# EAGLE design murdock_mcu_v3 (EAGLE 6.3)
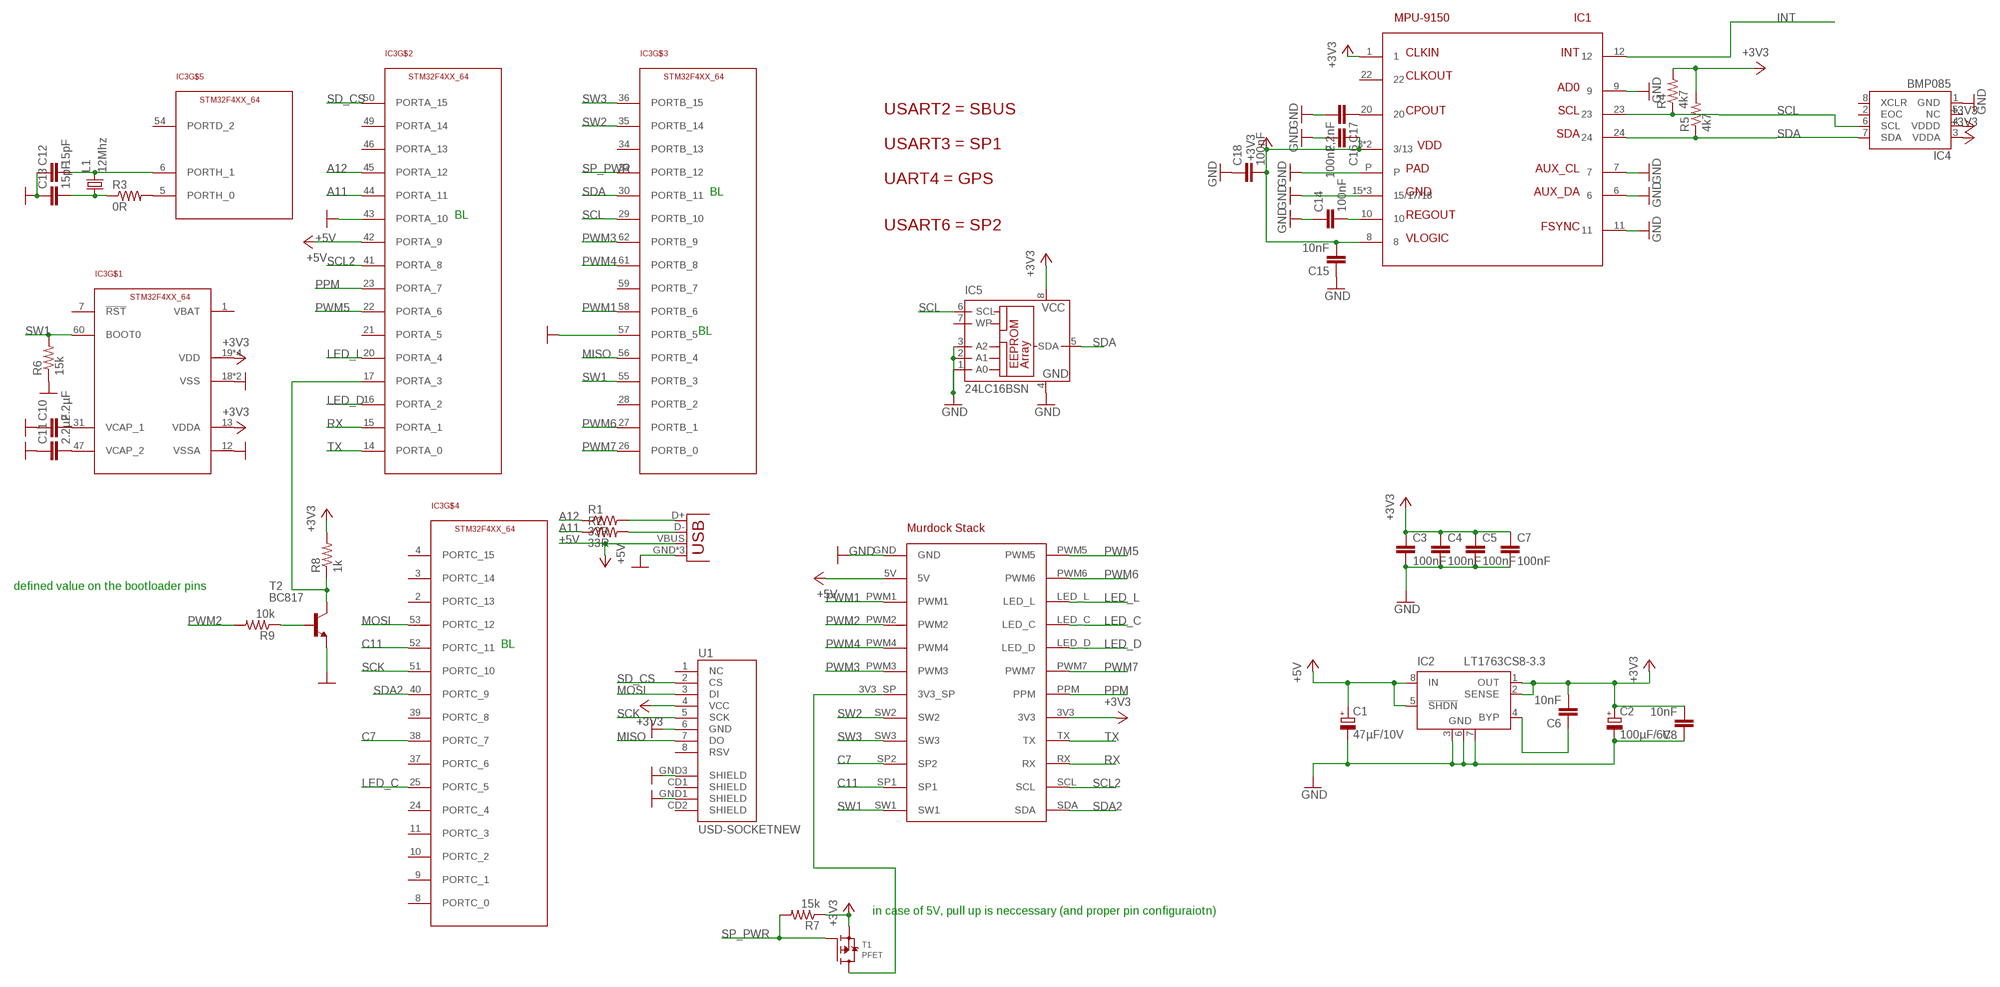
[diagram p0: schematic, sheet 1]

## Parts
C1  47µF/10V  CPOL-EUSMCC  [SMC_C]
C2  100µF/6V  CPOL-EUSMCC  [SMC_C]
C3  100nF  CAP0402-CAP  [0402-CAP]
C4  100nF  CAP0402-CAP  [0402-CAP]
C5  100nF  CAP0402-CAP  [0402-CAP]
C6  10nF  C-EUC0402  [C0402]
C7  100nF  CAP0402-CAP  [0402-CAP]
C8  10nF  C-EUC0402  [C0402]
C10  2.2µF  CAP0805  [0805]
C11  2.2µF  CAP0805  [0805]
C12  15pF  CAP0402-CAP  [0402-CAP]
C13  15pF  CAP0402-CAP  [0402-CAP]
C14  100nF  CAP0402-CAP  [0402-CAP]
C15  10nF  CAP0402-CAP  [0402-CAP]
C16  100nF  CAP0402-CAP  [0402-CAP]
C17  2,2nF  CAP0402-CAP  [0402-CAP]
C18  100nF  CAP0402-CAP  [0402-CAP]
IC1  MPU-9150  [QFN24]
IC2  LT1763CS8-3.3  [SOIC8]
IC3  STM32F4XX_64  [TQFP64]
IC4  BMP085  [BMP085]
IC5  24LC16BSN  [SO-08]
JP1  USB-MICROB  [USB-MICROB]
L1  12Mhz  X22-OSCILLATOR  [X22]
R1  33R  RESISTOR0402-RES  [0402-RES]
R2  33R  RESISTOR0402-RES  [0402-RES]
R3  0R  RESISTOR0402-RES  [0402-RES]
R4  4k7  RESISTOR0402-RES  [0402-RES]
R5  4k7  RESISTOR0402-RES  [0402-RES]
R6  15k  RESISTOR0402-RES  [0402-RES]
R7  15k  RESISTOR0402-RES  [0402-RES]
R8  1k  RESISTOR0402-RES  [0402-RES]
R9  10k  RESISTOR0402-RES  [0402-RES]
T1  PFET  MOSFET-P  [SOT23-R]
T2  BC817  BC847  [SOT23]
U1  USD-SOCKETNEW  [MICRO-SD-SOCKET-PP]
X2  MURDOCK_STACK  [MURDOCK_STACK]

## Nets
+3V3: C2.+ C3.1 C4.1 C5.1 C6.2 C7.1 C8.2 C15.2 C16.1 C18.2 IC1.1 IC1.3(3/13) IC1.8 IC1.13(3/13) IC2.1(OUT) IC2.2(SENSE) IC3.13(VDDA) IC3.19(VDD) IC3.32(VDD) IC3.48(VDD) IC3.64(VDD) IC4.3(VDDA) IC4.4(VDDD) IC5.8(VCC) R4.2 R5.2 R7.1 R8.2 T1.2(S) U1.4(VCC) X2.3V3
+5V: C1.+ IC2.5(!SHDN) IC2.8(IN) IC3.42(PORTA_9) JP1.VBUS X2.5V
A11: IC3.44(PORTA_11) R2.1
A12: IC3.45(PORTA_12) R1.1
C7: IC3.38(PORTC_7) X2.SP2
C11: IC3.52(PORTC_11) X2.SP1
GND: C1.- C2.- C3.2 C4.2 C5.2 C7.2 C8.1 C10.1 C11.1 C12.1 C13.1 C14.1 C15.1 C16.2 C17.2 C18.1 IC1.6 IC1.7 IC1.9 IC1.11 IC1.15(15/17/18) IC1.17(15/17/18) IC1.18(15/17/18) IC1.P IC2.3(GND) IC2.6(GND) IC2.7(GND) IC3.12(VSSA) IC3.18(VSS) IC3.43(PORTA_10) IC3.57(PORTB_5) IC3.63(VSS) IC4.1(GND) IC5.1(A0) IC5.2(A1) IC5.3(A2) IC5.4(GND) JP1.GND JP1.MT1(GND) JP1.MT2(GND) R6.1 T2.2(E) U1.6(GND) U1.GND1(SHIELD) U1.GND3(SHIELD) X2.GND
INT: IC1.12
LED_C: IC3.25(PORTC_5) X2.LED_C
LED_D: IC3.16(PORTA_2) X2.LED_D
LED_L: IC3.20(PORTA_4) X2.LED_L
MISO: IC3.56(PORTB_4) U1.7(DO)
MOSI: IC3.53(PORTC_12) U1.3(DI)
N$1: JP1.D- R2.2
N$2: JP1.D+ R1.2
N$3: C10.2 IC3.31(VCAP_1)
N$4: C11.2 IC3.47(VCAP_2)
N$5: IC3.5(PORTH_0) R3.2
N$6: C13.2 L1.1 R3.1
N$7: C12.2 IC3.6(PORTH_1) L1.3
N$8: T1.3(D) X2.3V3_SP
N$9: C14.2 IC1.10
N$10: C17.1 IC1.20
N$11: IC3.17(PORTA_3) R8.1 T2.3(C)
N$12: R9.1 T2.1(B)
N$13: C6.1 IC2.4(BYP)
PPM: IC3.23(PORTA_7) X2.PPM
PWM1: IC3.58(PORTB_6) X2.PWM1
PWM2: R9.2 X2.PWM2
PWM3: IC3.62(PORTB_9) X2.PWM3
PWM4: IC3.61(PORTB_8) X2.PWM4
PWM5: IC3.22(PORTA_6) X2.PWM5
PWM6: IC3.27(PORTB_1) X2.PWM6
PWM7: IC3.26(PORTB_0) X2.PWM7
RX: IC3.15(PORTA_1) X2.RX
SCK: IC3.51(PORTC_10) U1.5(SCK)
SCL: IC1.23 IC3.29(PORTB_10) IC4.6(SCL) IC5.6(SCL) R4.1
SCL2: IC3.41(PORTA_8) X2.SCL
SD_CS: IC3.50(PORTA_15) U1.2(CS)
SDA: IC1.24 IC3.30(PORTB_11) IC4.7(SDA) IC5.5(SDA) R5.1
SDA2: IC3.40(PORTC_9) X2.SDA
SP_PWR: IC3.33(PORTB_12) R7.2 T1.1(G)
SW1: IC3.55(PORTB_3) IC3.60(BOOT0) R6.2 X2.SW1
SW2: IC3.35(PORTB_14) X2.SW2
SW3: IC3.36(PORTB_15) X2.SW3
TX: IC3.14(PORTA_0) X2.TX
Unconnected: IC1.22 IC3.1(VBAT) IC3.2(PORTC_13) IC3.3(PORTC_14) IC3.4(PORTC_15) IC3.7(!RST) IC3.8(PORTC_0) IC3.9(PORTC_1) IC3.10(PORTC_2) IC3.11(PORTC_3) IC3.21(PORTA_5) IC3.24(PORTC_4) IC3.28(PORTB_2) IC3.34(PORTB_13) IC3.37(PORTC_6) IC3.39(PORTC_8) IC3.46(PORTA_13) IC3.49(PORTA_14) IC3.54(PORTD_2) IC3.59(PORTB_7) IC4.2(EOC) IC4.5(NC) IC4.8(XCLR) IC5.7(WP) U1.1(NC) U1.8(RSV) U1.CD1(SHIELD) U1.CD2(SHIELD)

## Notes on the sheet
- USART2 = SBUS
- USART3 = SP1
- UART4 = GPS
- BL
- BL
- USART6 = SP2
- BL
- defined value on the bootloader pins
- BL
- in case of 5V, pull up is neccessary (and proper pin configuraiotn)

## Library data of the parts
C1 C2 = rcl:CPOL-EU: POLARIZED CAPACITOR, European symbol
C3-C5 C7 C10-C13 = SparkFun-Capacitors:CAP: Capacitor Standard 0603 ceramic capacitor, and 0.1" leaded capacitor.
C6 C8 = rcl:C-EU: CAPACITOR, European symbol
C14-C18 = SparkFun:CAP: Capacitor Standard 0603 ceramic capacitor, and 0.1" leaded capacitor.
IC1 = seb:MPU-9150
IC2 = linear-technology:LT1763CS8: 500mA, Low Noise, LDO Micropower Regulators Source: http://cds.linear.com/docs/Datasheet/1763ff.pdf; MPN: LT1763CS8-3.3; OC_FARNELL: 1273617; OC_NEWARK: 57M6055
IC3 = stm32:STM32F4XX_64
IC4 = SparkFun-Sensors:BMP085: BMP085 Pressure Sensor Great little MEMS pressure sensor. SKU: COM-09603
IC5 = microchip:24*: Serial EEPROM I2C; MF: MICROCHIP; MPN: 24LC16B/SN; OC_FARNELL: 9757945; OC_NEWARK: 12C2012
JP1 = SparkFun-Connectors:USB: USB Connectors USB-B-PTH is fully proven SKU : PRT-00139/CONN-08278 USB-miniB is fully proven SKU : PRT-00587 USB-A-PCB is untested. USB-A-H is throughly reviewed, but untested. Spark Fun Electronics SKU : PRT-00437 USB-B-SMT is throughly reviewed, but untested. Needs silkscreen touching up. USB-A-S has not been used/tested USB-MB-H has not been used/tested USB-MICROB has been used. CONN-09505; PROD_ID: CONN-09505
L1 = seb:X22-OSCILLATOR
R1-R3 R7-R9 = SparkFun-Resistors:RESISTOR: Resistor
R4-R6 = SparkFun:RESISTOR: Resistor
T1 = microbuilder:MOSFET-P: P-Channel Mosfet LEGEND VDS: Voltage Drain-Source ID: Drain Current RDS(ON): Drain-Source On-State Resistance VGS(TH): Gate-Source Threshold Voltage CISS: Drain-Source Input Capacitance SOT-23 Name VDS ID RDS(ON) VGS(TH) CISS Order Number IRLML5103 30V 760mA 600 mOhm -- 75pF @ 25V Digikey: IRLML5103PBFCT-ND IRLML6401 12V 4.3A 50 mOhm 950mV @ 250µA 830pF @ 10V Digikey: IRLML6401PBFTR-ND NTR0202PL 20V 400mA 800 mOhm 2.3V @ 250uA 70pF @ 5V Digikey: NTR0202PLT1GOSTR-ND NTR4101PT1G 20V 1.8A 85 mOhm 1.2V @ 250uA 675pF @ 10V Digikey: NTR4101PT1GOSCT-ND DMP2004K 20V 600mA 900 mOhm 1V @ 250uA 175pF @ 16V Digikey: DMP2004KDICT-ND PMV65XP 20V 3.9A 76 mOhm 950mV @ 1mA 725pF @ 20V Digikey: 568-2358-2-ND TO-252 Name VDS ID RDS(ON) VGS(TH) CISS Order Number AOD417 30V 25A 34 mOhm 3V @ 250µA 920pF @ 15V Digikey: 785-1106-2-ND
T2 = transistor:BC847: NPN TRANSISTOR
U1 = SparkFun-Connectors:USD-SOCKET: microSD Socket Push-push type uSD socket. Schematic element and footprint production proven. Spark Fun Electronics SKU : PRT-00127. tDoc lines correctly indicate media card edge positions when inserting (unlocked, locked, depressed).
X2 = murdock:MURDOCK_STACK

## Board
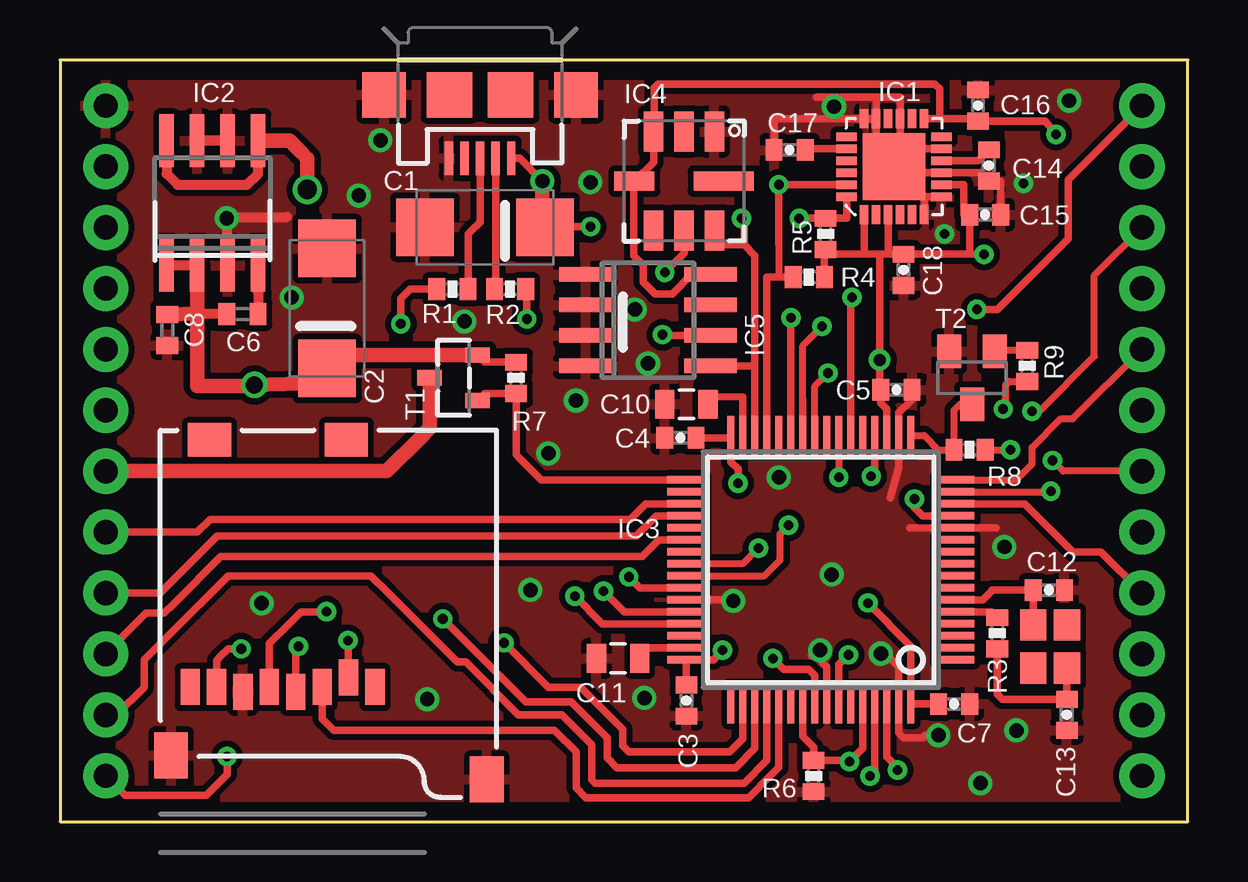
[diagram p1: board, top side]
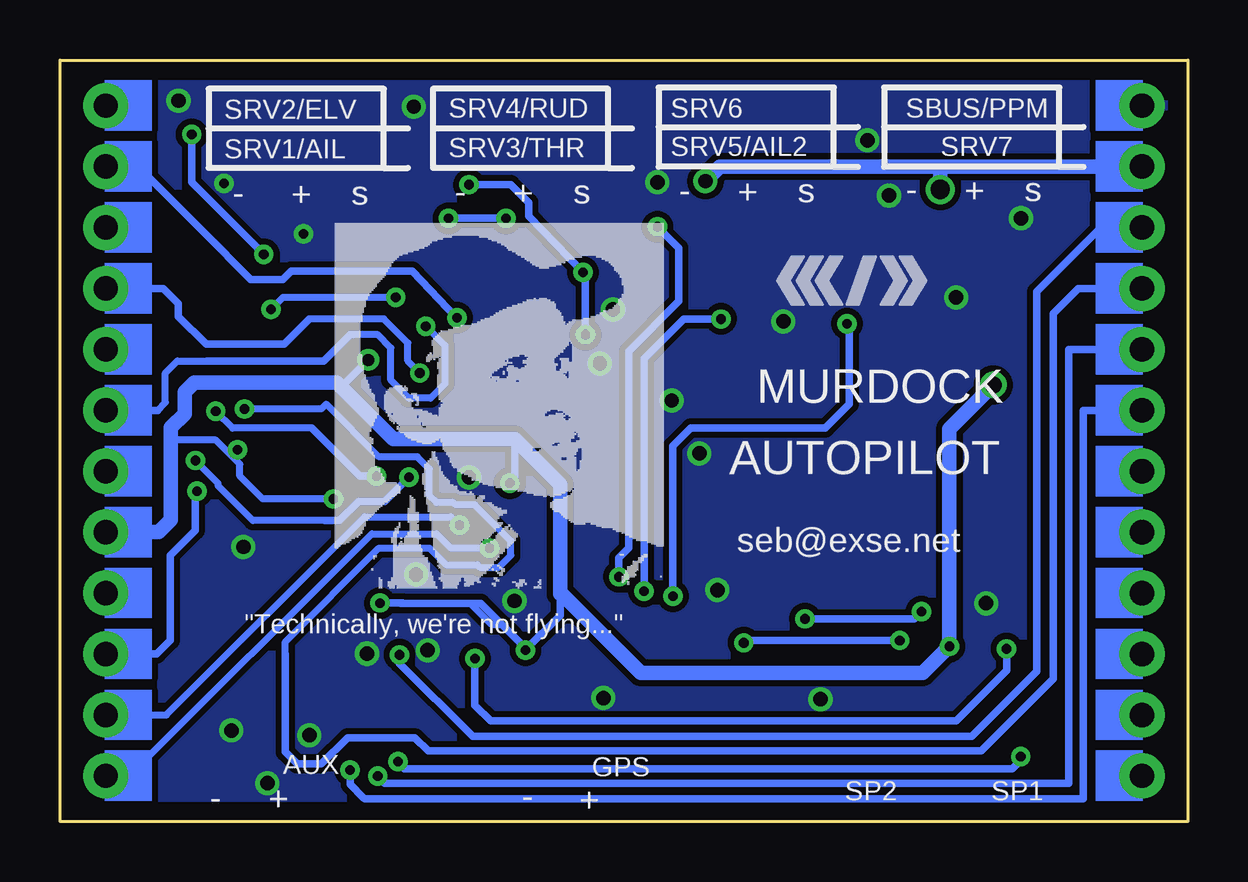
[diagram p2: board, bottom side, seen from below]

Size 46.99 x 31.75 mm. Coordinates in mm from the lower left corner, seen from the top.
Copper layers (1*16): Top 0.035mm / dielectric 1.5mm / Bottom 0.035mm
Design rules "default": minimum track width 10mil, minimum drill 0.4mm, track to track 8mil, track to pad 8mil, pad to pad 8mil, via to via 8mil, smd to smd 8mil, copper to edge 30mil, drill to drill 8mil, minimum pad ring 10mil, minimum via ring 8mil, stop-mask expansion 4mil, vias tented up to drill 1.5mm, thermal gap 10mil

### Footprints (pad centres in the part's own frame; a part is rotated, then mirrored left to right if it is on the bottom)
SMC_C = smd 2.4 x 2.4: + -2.5,0; - 2.5,0
0402-CAP = smd 0.7 x 0.9: 1 -0.65,0; 2 0.65,0
C0402 = smd 0.7 x 0.9: 1 -0.65,0; 2 0.65,0
0805 = smd 0.8 x 1.2: 1 -0.9,0; 2 0.9,0
QFN24 = smd 0.8 x 0.35: 1 -2,1.25; 2 -2,0.75; 3 -2,0.25; 4 -2,-0.25; 5 -2,-0.75; 6 -2,-1.25; 13 2,-1.25; 14 2,-0.75; 15 2,-0.25; 16 2,0.25; 17 2,0.75; 18 2,1.25 | smd 0.35 x 0.85: 7 -1.25,-1.975; 8 -0.75,-1.975; 9 -0.25,-1.975; 10 0.25,-1.975; 11 0.75,-1.975; 12 1.25,-1.975; 19 1.25,1.975; 20 0.75,1.975; 21 0.25,1.975; 22 -0.25,1.975; 23 -0.75,1.975; 24 -1.25,1.975 | smd 2.8 x 2.6: P 0,0
SOIC8 = smd 0.6 x 2.2: 1 -1.905,-2.6; 2 -0.635,-2.6; 3 0.635,-2.6; 4 1.905,-2.6; 5 1.905,2.6; 6 0.635,2.6; 7 -0.635,2.6; 8 -1.905,2.6
TQFP64 = smd 0.3 x 1.6: 1 -3.75,-5.6; 2 -3.25,-5.6; 3 -2.75,-5.6; 4 -2.25,-5.6; 5 -1.75,-5.6; 6 -1.25,-5.6; 7 -0.75,-5.6; 8 -0.25,-5.6; 9 0.25,-5.6; 10 0.75,-5.6; 11 1.25,-5.6; 12 1.75,-5.6; 13 2.25,-5.6; 14 2.75,-5.6; 15 3.25,-5.6; 16 3.75,-5.6; 33 3.75,5.6; 34 3.25,5.6; 35 2.75,5.6; 36 2.25,5.6; 37 1.75,5.6; 38 1.25,5.6; 39 0.75,5.6; 40 0.25,5.6; 41 -0.25,5.6; 42 -0.75,5.6; 43 -1.25,5.6; 44 -1.75,5.6; 45 -2.25,5.6; 46 -2.75,5.6; 47 -3.25,5.6; 48 -3.75,5.6 | smd 1.6 x 0.3: 17 5.6,-3.75; 18 5.6,-3.25; 19 5.6,-2.75; 20 5.6,-2.25; 21 5.6,-1.75; 22 5.6,-1.25; 23 5.6,-0.75; 24 5.6,-0.25; 25 5.6,0.25; 26 5.6,0.75; 27 5.6,1.25; 28 5.6,1.75; 29 5.6,2.25; 30 5.6,2.75; 31 5.6,3.25; 32 5.6,3.75; 49 -5.6,3.75; 50 -5.6,3.25; 51 -5.6,2.75; 52 -5.6,2.25; 53 -5.6,1.75; 54 -5.6,1.25; 55 -5.6,0.75; 56 -5.6,0.25; 57 -5.6,-0.25; 58 -5.6,-0.75; 59 -5.6,-1.25; 60 -5.6,-1.75; 61 -5.6,-2.25; 62 -5.6,-2.75; 63 -5.6,-3.25; 64 -5.6,-3.75
BMP085 = smd 1.67 x 0.8: 1 -2.065,1.27; 2 -2.065,0; 3 -2.065,-1.27; 5 2.065,-1.27; 6 2.065,0; 7 2.065,1.27 | smd 0.8 x 1.67: 4 0,-2.065 | smd 0.8 x 2.5: 8 0,1.65
SO-08 = smd 0.6 x 2.2: 1 -1.905,-2.6; 2 -0.635,-2.6; 3 0.635,-2.6; 4 1.905,-2.6; 5 1.905,2.6; 6 0.635,2.6; 7 -0.635,2.6; 8 -1.905,2.6
USB-MICROB = smd 0.35 x 1.4: D+ 0,2.65; D- -0.65,2.65; GND 1.3,2.65; ID 0.65,2.65; VBUS -1.3,2.65 | smd 1.8 x 1.9: MT1 -4,0; MT2 4,0 | smd 1.9 x 1.9: P$1 -1.27,0; P$2 1.27,0
X22 = smd 1.3 x 1.1: 1 0.9,0.7; 2 -0.9,0.7; 3 -0.9,-0.7; 4 0.9,-0.7
0402-RES = smd 0.7 x 0.9: 1 -0.65,0; 2 0.65,0
SOT23-R = smd 0.635 x 1.016: 1 -0.95,-1; 2 0.95,-1; 3 0,1
SOT23 = smd 1 x 1.4: 1 -0.95,-1.1; 2 0.95,-1.1; 3 0,1.1
MICRO-SD-SOCKET-PP = smd 0.8 x 1.5: 1 -8.94,10.7; 2 -7.84,10.3; 3 -6.74,10.7; 4 -5.64,10.9; 5 -4.54,10.7; 6 -3.44,10.9; 7 -2.34,10.7; 8 -1.24,10.7 | smd 1.8 x 1.4: CD1 -2.05,0.4; CD2 -7.75,0.4 | smd 1.4 x 1.9: GND1 -13.6,14.55; GND3 -0.45,13.55
MURDOCK_STACK = drill 1.016 pad 1.88: 3V3 45.085,12.065; 3V3_SP 1.905,14.605; 5V 1.905,27.305; GND 1.905,29.845; LED_C 45.085,22.225; LED_D 45.085,19.685; LED_L 45.085,24.765; PPM 45.085,14.605; PWM1 1.905,24.765; PWM2 1.905,22.225; PWM3 1.905,17.145; PWM4 1.905,19.685; PWM5 45.085,29.845; PWM6 45.085,27.305; PWM7 45.085,17.145; RX 45.085,6.985; SCL 45.085,4.445; SDA 45.085,1.905; SP1 1.905,4.445; SP2 1.905,6.985; SW1 1.905,1.905; SW2 1.905,12.065; SW3 1.905,9.525; TX 45.085,9.525

### Placement (x,y rotation side)
C1  17.71,24.78 180 top
C2  11.13,21.39 90 top
C3  26.1,5.05 270 top
C4  25.85,16 180 top
C5  34.85,18 0 top
C6  7.6,21.16 180 top
C7  37.25,4.9 0 top
C8  4.47,20.49 90 top
C10  26.1,17.4 0 top
C11  23.25,6.8 0 top
C12  41.2,9.65 180 top
C13  41.95,4.45 90 top
C14  38.7,27.35 90 top
C15  38.55,25.3 180 top
C16  38.25,29.85 90 top
C17  30.4,28 180 top
C18  35.15,23 90 top
IC1  34.75,27.3 90 top
IC2  6.35,25.79 0 top
IC3  31.7,10.5 90 top
IC4  26,26.7 270 top
IC5  24.5,20.9 270 top
JP1  17.5,30.3 180 top
L1  41.25,7.3 270 top
R1  16.35,22.2 0 top
R2  18.75,22.2 180 top
R3  39.05,7.85 90 top
R4  31.2,22.7 0 top
R5  31.9,24.5 270 top
R6  31.4,1.9 90 top
R7  19,18.5 270 top
R8  37.9,15.5 0 top
R9  40.3,19 270 top
T1  16.4,18.5 90 top
T2  38,18.5 180 top
U1  4.18,16.31 180 top
U$1  [C3D2_LOGO_SMALL]  17.1,22.55 0 bottom
X2  0,0 0 top

### Tracks (layer width: path | path; a pad name or v marks a point on that pad's centre or on a via)
+3V3  (via drill 0.4, 0.5, 0.7)
  Top 0.3: R8.2 v39.6,15.5
  Top 0.305: IC3.19 34.45,17.2 34.2,17.45 C5.1 34.15,18.05 v34.15,19.25 34.15,23.6 34.1,23.65 | C3.1 IC3.48 27.25,6.75 v27.6,7.15 | C4.1 27.95,16 IC3.32 27.95,15 28.25,14.7 v28.25,14.1 | C7.1 IC3.64 35.45,7.3 v33.66,9.11 | IC1.13 36.65,29.3 | 36.65,29.3 38.25,29.3 C16.1 41.05,29.2 v41.5,28.65 | IC1.8 37.65,26.55 37.65,25.3 C15.2 37.9,23.65 | 37.9,23.65 C18.2 34.5,23.65 | IC1.3 34.5,23.65 | 33.5,23.65 31.75,23.65 R5.2 31.85,23.8 R4.2 | 33.5,23.65 34.1,23.65 | 34.1,23.65 34.5,23.65 | IC1.1 33.5,23.65 | v38.5,23.65 37.9,23.65 | 36.65,29.3 36.65,30.55 36.45,30.75 24.9,30.75 24.75,30.6 24.75,28.79 IC4.3 24.73,27.5 IC4.4 23.9,26.66 23.9,23.6 24.3,23.2 24.3,22.5 24.8,22 25.5,22 26.3,22.8 IC5.8 | IC3.13 35.95,12.75 35.6,13.1 v35.6,13.45 | 5.71,18.45 5.71,18.5 | T1.2 17.7,19.15 R7.1 | U1.4 9.82,7.19 v9.93,7.3
  Top 0.406: C6.2 5.76,21.16 5.71,21.17 | IC2.2 IC2.1
  Top 0.61: 5.71,21.17 IC2.2 | C8.2 5.71,21.17 | 5.71,21.17 5.71,18.5 5.71,18.16 7.95,18.16 v8.1,18.2 8,18.2 10.77,18.27 C2.+ 11.13,19.45 T1.2
  Bottom 0.3: 27.6,7.25 28.55,8.2 29,8.2 29.9,9.1 32.8,9.1 | v35.6,13.45 38.55,13.45 39.5,14.4 39.5,14.9 40,15.4 | 40,15.4 40.5,15.9 42.37,15.9 | v39.6,15.5 39.7,15.4 40,15.4
  Bottom 0.305: 26.15,9.5 26.15,8.6 v27.6,7.15 27.6,7.25 29.45,9.1 32.8,9.1 32.71,9.11 v33.66,9.11 | 28.05,15.95 28.05,14.3 v28.25,14.1 | v38.5,23.65 41.5,26.65 v41.5,28.65 | v34.15,19.25 35.27,18.12
  Bottom 0.61: 26.15,9.5 26.15,9.55 | 26.15,9.55 26.15,14.05 28.05,15.95 33.1,15.95 35.27,18.12 35.45,18.3 41.4,18.3 41.8,17.9 41.8,17 42.37,16.43 42.37,15.9 42.37,12.57 42.88,12.06 X2.3V3 | 26.15,9.55 22.8,6.2 11.03,6.2 v9.93,7.3 9.93,16.37 v8.1,18.2
+5V  (via drill 0.4, 0.6, 0.8)
  Top 0.305: 19.15,27.65 JP1.VBUS 19.15,27.65 | v20.1,26.7 19.15,27.65 | IC3.42 24.15,9.75 v23.7,10.2 | v22.1,24.8 20.23,24.8 C1.+
  Top 0.406: IC2.8 4.45,27 4.9,26.55 7.8,26.55 8.25,27 8.25,27.23 IC2.5
  Top 0.61: IC2.5 9.56,28.39 10.05,27.9 10.31,27.64 v10.31,26.35 | C1.+ 20.1,24.39 v20.1,26.7
  Bottom 0.305: v23.7,10.2 23.7,11 23.3,11.4 23.3,19.6 21.2,21.7 21.2,23.9 v22.1,24.8
  Bottom 0.61: 9.35,27.3 X2.5V | 9.35,27.3 19.5,27.3 v20.1,26.7 | 9.35,27.3 10.31,27.3 v10.31,26.35
A11  (via drill 0.4)
  Top 0.305: IC3.44 23.5,8.75 v22.65,9.6 | R2.1 19.45,22.15 v19.45,20.95
  Bottom 0.305: v22.65,9.6 22.65,19.3 21,20.95 v19.45,20.95
A12  (via drill 0.4)
  Top 0.305: IC3.45 22.6,8.25 v21.45,9.4 | R1.1 14.6,22.2 14.3,21.9 14.2,21.8 v14.2,20.75
  Bottom 0.305: 14.15,20.75 v14.2,20.75 14.1,20.65 14.1,17.4 15.1,16.4 20.7,16.4 21.45,15.65 v21.45,9.4
C7
  Top 0.305: IC3.38 24.95,11.75 24.7,11.5 24.25,11.05 20.3,11.05 6.7,11.05 4.75,9.1 4.35,8.7 3.6,8.7 1.91,7 X2.SP2
C11
  Top 0.305: IC3.52 29.45,2.55 28.5,1.6 22.3,1.6 22.15,1.75 22.15,3.2 20.9,4.45 19.1,4.45 16.9,6.65 16.55,6.65 13.65,9.55 12.95,10.25 7,10.25 5.5,8.75 3.5,6.75 3.5,6.25 3.5,5.6 2.35,4.45 X2.SP1
GND  (via drill 0.4, 0.6)
  Top 0.305: C5.2 35.5,17.6 34.95,17.05 IC3.18 34.95,14.75 34.6,13.5 | 35.4,12.25 IC3.12 39,12.25 | 34.6,6.8 34.95,6.45 IC3.63 34.95,3.7 35.15,3.5 35.95,3.5 36.05,3.6 | IC1.11 35.8,28.05 35.6,27.85 | 35.6,27.85 35.6,27.3 | 35.6,27.3 35.85,27.05 IC1.9 38.35,27.05 C14.1 39.2,26.7 C15.1 | IC1.7 36,26.05 | 36,26.05 35.85,26.05 35.6,26.3 35.6,27.3 | IC1.6 36,26.05 | 35,28.05 IC1.15 35,30.2 34,30.2 | 35,28.05 35,27.85 | 35,27.85 35.6,27.85 | IC1.17 34,28.05 35,28.05 | IC1.17 IC1.18 29.75,29.3 C17.2 | 35,27.85 35,27.3 IC1.P | IC1.17 34,30.2 | 34,30.2 31.5,30.2 | IC3.43 28,9.25 v28.05,9.2 | IC3.57 31.95,6.45 31.5,6.9 31.3,6.9 v31.67,7.14
  Top 0.406: IC2.6 IC2.7 | IC2.3 6.99,23.84 6.95,25.2 9.45,25.2
  other vias: 16.85,20.85 29.95,14.35 42.05,30.05 21.5,17.55 36.6,3.6 39.85,3.8 39.35,11.45 32.15,10.3 19.6,9.65 23.95,21.35 13.35,28.4 12.45,26.1 6.95,25.15 8.4,9.1 24.35,5.15 32.25,29.8 36.85,24.5 24.5,19.1 9.65,21.85 22.1,26.65 38.35,1.6 34.2,7 20.35,15.35 15.3,5.1 40.15,26.6
  pour Top (isolate 0.254): 46.99,0 46.99,33.02 -0.95,33.02 -0.95,0
  pour Bottom (isolate 0.254): 46.99,0 46.99,33.02 -0.95,33.02 -0.95,0
LED_C  (via drill 0.4)
  Top 0.3: IC3.25 31.45,18.15 v32,18.7
  Bottom 0.3: v32,18.7 32,18.75 v32,18.7 | v32,18.7 32.5,19.2 32.5,19.95 33.5,20.95 36.6,20.95
  Bottom 0.305: X2.LED_C 42.7,22.23 42.57,22.1 42.06,21.59 42.06,21.06 40.9,19.9 37.65,19.9 36.6,20.95
LED_D
  Top 0.3: X2.LED_D 42.2,16.8 41.7,16.8 40.5,15.6 40.5,14.9 39.85,14.25 IC3.16
LED_L  (via drill 0.4)
  Top 0.3: X2.LED_L 43.1,22.78 43.1,19.4 40.8,17.1 v40.5,17.1
  Top 0.305: IC3.20 33.95,14.55 v33.8,14.4
  Bottom 0.3: 36.5,16.4 39.8,16.4 v40.5,17.1
  Bottom 0.305: v33.8,14.4 34.5,14.4 36.5,16.4
MISO  (via drill 0.4)
  Top 0.305: IC3.56 31.45,6.1 31.2,6.35 30.15,6.35 v29.7,6.8 | U1.7 6.52,6.72 6.7,6.9 7,7.2 v7.55,7.2
  Bottom 0.305: v29.7,6.8 29.7,4.85 29.05,4.2 9.65,4.2 8.9,4.95 7.55,6.3 v7.55,7.2
MOSI
  Top 0.305: IC3.53 29.95,2.25 29.6,1.9 28.7,1 21.9,1 21.5,1.4 21.5,2.9 20.6,3.8 17.3,3.8 16.45,3.8 14.3,3.8 13.55,3.8 11.4,3.8 11,4.2 10.92,4.28 U1.3
N$1
  Top 0.305: JP1.D- 18.15,22.65 18.1,22.6 R2.2
  Top 0.406: R2.2 17.98,22.12
N$2
  Top 0.305: JP1.D+ 17.5,25 17.1,24.6 17,24.5 R1.2
  Top 0.406: 16.98,22.08 R1.2
N$3
  Top 0.3: 28.45,17.7 27.3,17.7 C10.2
  Top 0.305: IC3.31 28.45,17.7
N$4
  Top 0.305: IC3.47 25.25,7.25 24.2,7.25 C11.2
N$5
  Top 0.305: IC3.5 38.8,8.75 R3.2
N$6
  Top 0.305: R3.1 39.05,5.3 39.25,5.1 C13.2 L1.1
N$7
  Top 0.305: L1.3 C12.2 38.85,9.65 38.8,9.6 38.45,9.25 IC3.6
N$8
  Top 0.61: X2.3V3_SP 3.6,14.61 13.61,14.61 15,16 15.4,16.4 T1.3
N$9
  Top 0.305: IC1.10 38.25,27.55 C14.2
N$10
  Top 0.305: IC1.20 31.05,28.05 C17.1
N$11
  Top 0.3: IC3.17 36,16.1 36.6,15.5 R8.1 37.25,17.15 37.5,17.4 T2.3
N$12
  Top 0.3: T2.1 39,19.65 R9.1
N$13
  Top 0.406: IC2.4 8.25,22.04 C6.1
PPM  (via drill 0.4)
  Top 0.3: IC3.23 v32.45,14.35 | 44.35,14.61 41.8,14.61 v41.35,15.05
  Top 0.305: 44.35,14.61 X2.PPM
  Bottom 0.3: 35.95,12.55 38.95,12.55 40.4,14 40.4,14.1 v41.35,15.05
  Bottom 0.305: 35.95,12.55 35.35,12.55 34.55,13.35 33.45,13.35 v32.45,14.35
PWM1  (via drill 0.4)
  Top 0.305: IC3.58 32.45,6.55 v32.85,6.95
  Bottom 0.305: v32.85,6.95 32.85,6.6 29.8,3.55 9,3.55 6.29,6.26 6.29,6.75 6.29,22.1 3.62,24.77 X2.PWM1
PWM2  (via drill 0.4)
  Top 0.3: v39.3,17.2 39.4,17.3 39.4,18.2 39.55,18.35 R9.2
  Bottom 0.3: 37.6,7 37.6,7.5 33.7,11.4 31.6,11.4 30.9,10.7 29.6,10.7 29.5,10.6 28.7,10.6 28.2,11.1 28.2,11.7 29.7,13.2 30.5,13.2 30.6,13.3 31.3,13.3 31.6,13.6 31.6,14.7 32.1,15.2 33.7,15.2 35.9,17.4 36.1,17.2 v39.3,17.2
  Bottom 0.305: X2.PWM2 4.56,22.23 5.61,21.17 5.61,5.94 8.6,2.95 31.65,2.95 32.2,3.5 35,3.5 36.1,2.4 37.1,2.4 37.6,2.9 37.6,7
PWM3  (via drill 0.4)
  Top 0.305: v34.9,2.15 34.9,2.25 34.45,2.7 IC3.62
  Bottom 0.305: X2.PWM3 4.36,17.14 4.36,0.95 34.3,0.95 34.35,1 34.9,1.55 v34.9,2.15
PWM4  (via drill 0.4)
  Top 0.305: v33.75,1.9 33.95,2.1 IC3.61
  Bottom 0.305: X2.PWM4 4.96,19.68 4.96,1.6 33.35,1.6 33.45,1.6 v33.75,1.9
PWM5  (via drill 0.4)
  Top 0.305: IC3.22 32.95,18.05 32.95,21.8 v33,21.85 | X2.PWM5 42,26.76 42,24.3 39.05,21.35 v38.2,21.35
  Bottom 0.3: v33,21.85 37.7,21.85 v38.2,21.35
PWM6  (via drill 0.4)
  Top 0.305: v30.45,21 IC3.27
  Bottom 0.305: v30.45,21 32.3,22.95 37.35,22.95 37.7,22.6 39.03,22.6 41.02,24.59 43.74,27.3 44.51,27.3 X2.PWM6
PWM7  (via drill 0.4)
  Top 0.3: 30.95,17.6 30.95,19.85 v31.75,20.65
  Top 0.305: 30.95,17.6 IC3.26
  Bottom 0.3: v31.75,20.65 30.95,19.85 30.95,18.25 31.55,17.65 32.45,17.65 33.2,18.4 33.2,19.75 33.75,20.3 34.75,20.3 | 42.93,17.14 42.6,17.47 42.6,18.7 42.1,19.2 40.87,19.2
  Bottom 0.305: 42.93,17.14 X2.PWM7 | 40.87,19.2 36,19.2 34.9,20.3 34.75,20.3
RX  (via drill 0.4)
  Top 0.3: IC3.15 41.26,13.75 v41.28,13.78
  Bottom 0.305: X2.RX 42.95,6.99 42.39,7.54 42.39,11.1 41.35,12.14 41.35,13.71 v41.28,13.78
SCK  (via drill 0.4)
  Top 0.305: IC3.51 28.95,3.05 28.15,2.25 23.2,2.25 22.8,2.65 22.8,3.5 21.3,5 19.4,5 v15.95,8.45 | v11.1,8.75 11.05,8.75 10.05,8.75 9.5,8.2 8.72,7.42 U1.5
  Bottom 0.305: v15.95,8.45 11.4,8.45 v11.1,8.75
SCL  (via drill 0.4)
  Top 0.3: 29.95,24.05 29.95,22.75 29.9,22.7
  Top 0.305: IC3.29 29.45,22.7 29.9,22.7 R4.1 | 29.95,24.05 v29.95,26.55 IC1.23 | v25.2,22.9 26,23.7 IC4.6 | IC5.6 25.14,20.27 v25.1,20.3
  Bottom 0.305: v29.95,26.55 28.2,26.55 27.45,25.8 27.45,25.25 v25.2,22.9 25.1,22.8 v25.1,20.3
SCL2  (via drill 0.4)
  Top 0.3: IC3.41 29.35,10.25 30,10.9 30,12 v30.35,12.35 30.3,12.3
  Bottom 0.3: X2.SCL 42.55,4.45 34.3,12.7 30.7,12.7 v30.35,12.35
SD_CS  (via drill 0.4)
  Top 0.305: IC3.50 28.45,3.45 27.9,2.9 23.7,2.9 23.45,3.15 23.45,3.85 21.7,5.6 20.35,5.6 v18.5,7.45 | U1.2 12,6.03 v12,7.55
  Bottom 0.305: v18.5,7.45 18.4,7.55 v12,7.55
SDA  (via drill 0.4)
  Top 0.305: IC1.24 32.77,25.15 R5.1 v30.8,25.15 | IC3.30 28.95,19 | 28.95,19 28.95,23.6 28.5,24.05 | 28.5,24.05 28.5,25.05 v28.4,25.15 | IC4.7 27.45,24.05 28.5,24.05 | IC5.5 28.95,19
  Bottom 0.305: v28.4,25.15 v30.8,25.15
SDA2  (via drill 0.4)
  Top 0.3: v29.1,11.4 28.45,10.75 IC3.40
  Bottom 0.3: X2.SDA 44.09,1.91 34,12 31.3,12 30.7,11.4 v29.1,11.4
SP_PWR
  Top 0.305: IC3.33 24.35,14.25 20.05,14.25 19.1,15.2 19,15.3 R7.2 17.7,17.85 T1.1
SW1  (via drill 0.4)
  Top 0.305: IC3.60 33.45,3.05 v32.9,2.5 32.85,2.55 R6.2 31.4,3.1 31.2,3.3 30.95,3.55 IC3.55 | X2.SW1 2.71,1.1 5.1,1.1 6.1,1.1 6.96,1.96 v6.96,2.7
  Bottom 0.305: v6.96,2.7 6.96,2.55 7.31,2.2 32.65,2.2 v32.9,2.5
SW2
  Top 0.305: X2.SW2 5.71,12.06 6.25,12.6 23.75,12.6 24.4,13.25 IC3.35
SW3
  Top 0.305: X2.SW3 4.17,9.53 6.55,11.9 24,11.9 24.85,12.75 IC3.36
TX
  Top 0.305: IC3.14 40.2,13.25 41.2,12.25 42.2,11.25 43.36,11.25 X2.TX
(copper drawn outside any net)
  shapes: Bottom area x24

### Text on the board
bPlace: SBUS/PPM | SRV6 | SRV4/RUD | SRV2/ELV | SRV7 | SRV5/AIL2 | SRV3/THR | SRV1/AIL | s | + | - | s | + | - | s | + | - | s | + | - | MURDOCK | AUTOPILOT | seb@exse.net | "Technically, we're not flying..." | GPS | AUX | SP1 | SP2 | - | + | + | -
tNames: IC4